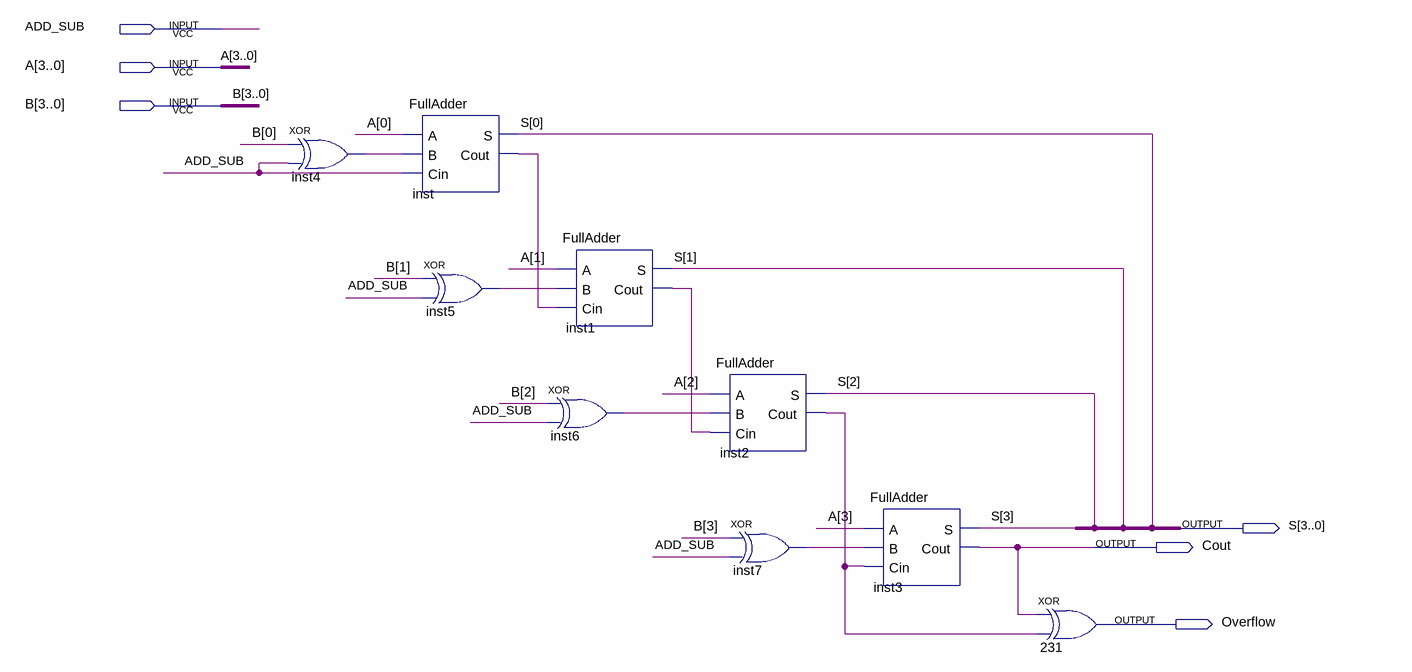
[diagram p0: schematic sheet]
// Quartus schematic AddSub4.bdf as structural Verilog: 9 symbols, 6 pins
module AddSub4 (
  input  ADD_SUB,
  input  [3:0] A,
  input  [3:0] B,
  output [3:0] S,
  output Cout,
  output Overflow
);

  wire inst1_cout, inst2_cout, inst4_out, inst5_out, inst6_out, inst7_out, inst_cout;

  xor inst4 (inst4_out, B[0], ADD_SUB);
  FullAdder inst (.A(A[0]), .B(inst4_out), .Cin(ADD_SUB), .S(S[0]), .Cout(inst_cout));
  xor inst5 (inst5_out, B[1], ADD_SUB);
  FullAdder inst1 (.A(A[1]), .B(inst5_out), .Cin(inst_cout), .S(S[1]), .Cout(inst1_cout));
  xor inst6 (inst6_out, B[2], ADD_SUB);
  FullAdder inst2 (.A(A[2]), .B(inst6_out), .Cin(inst1_cout), .S(S[2]), .Cout(inst2_cout));
  xor inst7 (inst7_out, B[3], ADD_SUB);
  FullAdder inst3 (.A(A[3]), .B(inst7_out), .Cin(inst2_cout), .S(S[3]), .Cout(Cout));
  xor u_231 (Overflow, Cout, inst2_cout);
endmodule
